# EAGLE design PCB_0014 (EAGLE 9.6.2)
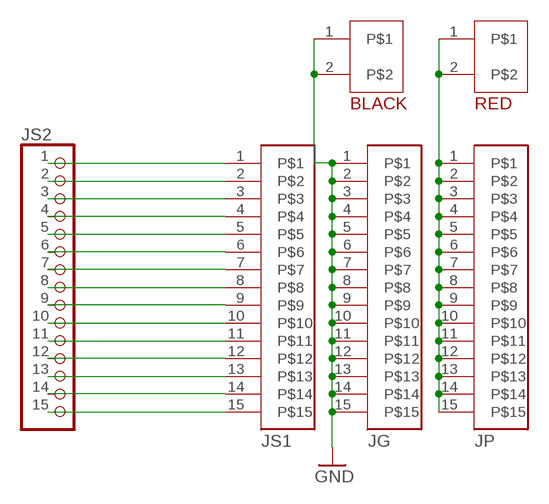
[diagram p0: schematic, sheet 1]

## Parts
BLACK  SCREWTERMINAL_2PIN  [DB125-3.5/3.81]
JG  HEADER_15X1  [HDRV15W64P254_1X15_3810X254X838B]
JP  HEADER_15X1  [HDRV15W64P254_1X15_3810X254X838B]
JS1  HEADER_15X1  [HDRV15W64P254_1X15_3810X254X838B]
JS2  PINHD-1X15  [1X15]
RED  SCREWTERMINAL_2PIN  [DB125-3.5/3.81]

## Nets
GND: BLACK.1 BLACK.2 JG.1 JG.2 JG.3 JG.4 JG.5 JG.6 JG.7 JG.8 JG.9 JG.10 JG.11 JG.12 JG.13 JG.14 JG.15
N$1: JS1.1 JS2.1
N$2: JS1.2 JS2.2
N$3: JS1.3 JS2.3
N$4: JS1.4 JS2.4
N$5: JS1.5 JS2.5
N$6: JS1.6 JS2.6
N$7: JS1.7 JS2.7
N$8: JS1.8 JS2.8
N$9: JS1.9 JS2.9
N$10: JS1.10 JS2.10
N$11: JS1.11 JS2.11
N$12: JS1.12 JS2.12
N$13: JS1.13 JS2.13
N$14: JS1.14 JS2.14
N$15: JS1.15 JS2.15
N$16: JP.1 JP.2 JP.3 JP.4 JP.5 JP.6 JP.7 JP.8 JP.9 JP.10 JP.11 JP.12 JP.13 JP.14 JP.15 RED.1 RED.2

## Library data of the parts
BLACK RED = SerialWombat_F360_Library:SCREWTERMINAL_2PIN
JG JP JS1 = SerialWombat_F360_Library:HEADER_15X1
JS2 = pinhead:PINHD-1X15: PIN HEADER

## Board
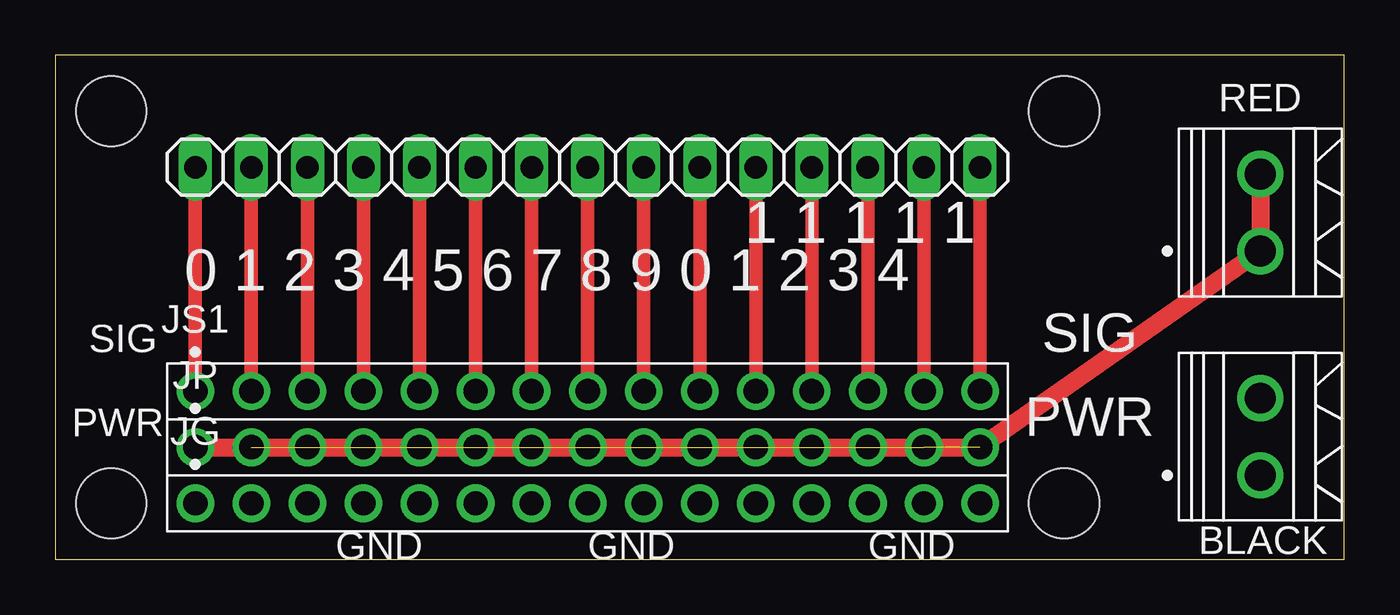
[diagram p1: board, top side]
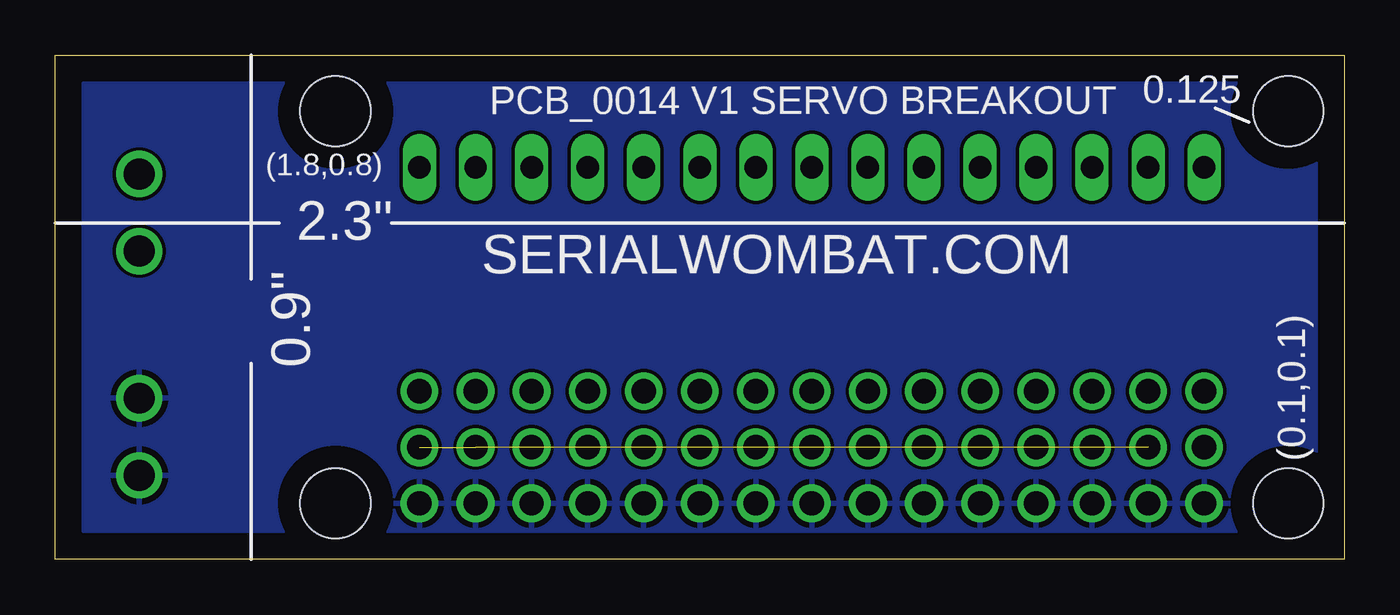
[diagram p2: board, bottom side, seen from below]

Size 58.42 x 22.86 mm. Coordinates in mm from the lower left corner, seen from the top.
Outline: 0,0 58.42,0 58.42,22.86 0,22.86 0,0
Copper layers (1*16): Top 0.035mm / dielectric 1.5mm / Bottom 0.035mm
Design rules "default": minimum track width 6mil, minimum drill 0.35mm, track to track 6mil, track to pad 6mil, pad to pad 6mil, via to via 6mil, smd to smd 6mil, copper to edge 40mil, drill to drill 6mil, minimum pad ring 10mil, minimum via ring 8mil, stop-mask expansion 4mil, vias tented up to drill 0mil, thermal gap 10mil
Holes 3.17 mm at 2.54,20.32 45.72,20.32 2.54,2.54 45.72,2.54

### Footprints (pad centres in the part's own frame; a part is rotated, then mirrored left to right if it is on the bottom)
DB125-3.5/3.81 = drill 1.4 pad 2: 1 0,0; 2 3.5,0
HDRV15W64P254_1X15_3810X254X838B = drill 1.105 pad 1.705: 1 0,0; 2 2.54,0; 3 5.08,0; 4 7.62,0; 5 10.16,0; 6 12.7,0; 7 15.24,0; 8 17.78,0; 9 20.32,0; 10 22.86,0; 11 25.4,0; 12 27.94,0; 13 30.48,0; 14 33.02,0; 15 35.56,0
1X15 = drill 1.016 long: 1 -17.78,0; 2 -15.24,0; 3 -12.7,0; 4 -10.16,0; 5 -7.62,0; 6 -5.08,0; 7 -2.54,0; 8 0,0; 9 2.54,0; 10 5.08,0; 11 7.62,0; 12 10.16,0; 13 12.7,0; 14 15.24,0; 15 17.78,0

### Placement (x,y rotation side)
BLACK  54.61,3.81 90 top
JG  6.35,2.54 0 top
JP  6.35,5.08 0 top
JS1  6.35,7.62 0 top
JS2  24.13,17.78 0 top
RED  54.61,13.97 90 top

### Tracks (layer width: path | path; a pad name or v marks a point on that pad's centre or on a via)
GND
  pour Bottom: 1.27,21.59 57.15,21.59 57.15,1.27 1.27,1.27
N$1
  Top 0.61: JS2.1 JS1.1
N$2
  Top 0.61: JS1.2 JS2.2
N$3
  Top 0.61: JS2.3 JS1.3
N$4
  Top 0.61: JS1.4 JS2.4
N$5
  Top 0.61: JS2.5 JS1.5
N$6
  Top 0.61: JS2.6 JS1.6
N$7
  Top 0.61: JS2.7 JS1.7
N$8
  Top 0.61: JS2.8 JS1.8
N$9
  Top 0.61: JS1.9 JS2.9
N$10
  Top 0.61: JS1.10 JS2.10
N$11
  Top 0.61: JS1.11 JS2.11
N$12
  Top 0.61: JS1.12 JS2.12
N$13
  Top 0.61: JS2.13 JS1.13
N$14
  Top 0.61: JS1.14 JS2.14
N$15
  Top 0.61: JS1.15 JS2.15
N$16  (13 unrouted)
  Top 0.813: RED.2 RED.1 JP.15 JP.1

### Text on the board
tPlace: 1 1 1 1 1 | 0 1 2 3 4 5 6 7 8 9 0 1 2 3 4 | SIG | SIG | PWR | PWR | GND | GND | GND
bPlace: 0.125 | PCB_0014 V1 SERVO BREAKOUT | (1.8,0.8) | 2.3" | SERIALWOMBAT.COM | 0.9" | (0.1,0.1)